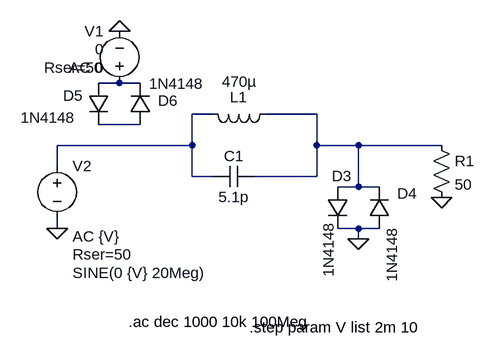
[diagram p0: schematic Probe.asc]
Probe.asc, the LTspice schematic file:
Version 4
SHEET 1 880 680
WIRE 160 48 128 48
WIRE 192 48 160 48
WIRE 304 96 272 96
WIRE 464 96 384 96
WIRE 192 112 128 112
WIRE 272 144 272 96
WIRE 272 144 64 144
WIRE 464 144 464 96
WIRE 528 144 464 144
WIRE 656 144 528 144
WIRE 64 176 64 144
WIRE 272 192 272 144
WIRE 304 192 272 192
WIRE 464 192 464 144
WIRE 464 192 368 192
WIRE 528 208 528 144
WIRE 528 208 496 208
WIRE 560 208 528 208
WIRE 64 272 64 256
WIRE 528 272 496 272
WIRE 560 272 528 272
WIRE 528 288 528 272
FLAG 64 272 0
FLAG 528 288 0
FLAG 160 -32 0
FLAG 656 224 0
SYMBOL ind 400 80 R90
WINDOW 0 5 56 VBottom 2
WINDOW 3 -50 55 VTop 2
SYMATTR InstName L1
SYMATTR Value 470µ
SYMBOL diode 480 208 R0
WINDOW 0 7 -17 Left 2
WINDOW 3 2 54 VRight 2
SYMATTR InstName D3
SYMATTR Value 1N4148
SYMBOL diode 576 272 R180
WINDOW 0 -43 54 Left 2
WINDOW 3 -4 -82 VRight 2
SYMATTR InstName D4
SYMATTR Value 1N4148
SYMBOL diode 112 48 R0
WINDOW 0 -39 19 Left 2
WINDOW 3 -104 53 Left 2
SYMATTR InstName D5
SYMATTR Value 1N4148
SYMBOL diode 208 112 R180
WINDOW 0 -42 37 Left 2
WINDOW 3 -82 63 Left 2
SYMATTR InstName D6
SYMATTR Value 1N4148
SYMBOL voltage 160 64 R180
WINDOW 0 24 96 Left 2
WINDOW 3 24 68 Left 2
WINDOW 123 24 40 Left 2
WINDOW 39 24 40 Left 2
SYMATTR InstName V1
SYMATTR Value 0
SYMATTR Value2 AC 0
SYMATTR SpiceLine Rser=50
SYMBOL voltage 64 160 R0
WINDOW 3 24 180 Left 2
WINDOW 123 24 124 Left 2
WINDOW 39 24 152 Left 2
SYMATTR InstName V2
SYMATTR Value SINE(0 {V} 20Meg)
SYMATTR Value2 AC {V}
SYMATTR SpiceLine Rser=50
SYMBOL res 640 128 R0
SYMATTR InstName R1
SYMATTR Value 50
SYMBOL cap 368 176 R90
WINDOW 0 0 32 VBottom 2
WINDOW 3 32 32 VTop 2
SYMATTR InstName C1
SYMATTR Value 5.1p
TEXT 174 416 Left 2 !.ac dec 1000 10k 100Meg
TEXT 360 424 Left 2 !.step param V list 2m 10

The netlist it stands for:
* Probe.asc
L1 N003 N002 470µ
D3 N003 0 1N4148
D4 0 N003 1N4148
D5 N001 N004 1N4148
D6 N004 N001 1N4148
V1 N001 0 0 AC 0 Rser=50
V2 N002 0 SINE(0 {V} 20Meg) AC {V} Rser=50
R1 N003 0 50
C1 N003 N002 5.1p
.model D D
.lib standard.dio
.ac dec 1000 10k 100Meg
.step param V list 2m 10
.backanno
.end